# Altium schematic sheet SCH_Template.SchDoc: SCH_Template
size B; Engineer: Benjamin Beaudoin; Revision: vX.X